# Altium schematic sheet 06. ETHERNET.SchDoc
size A
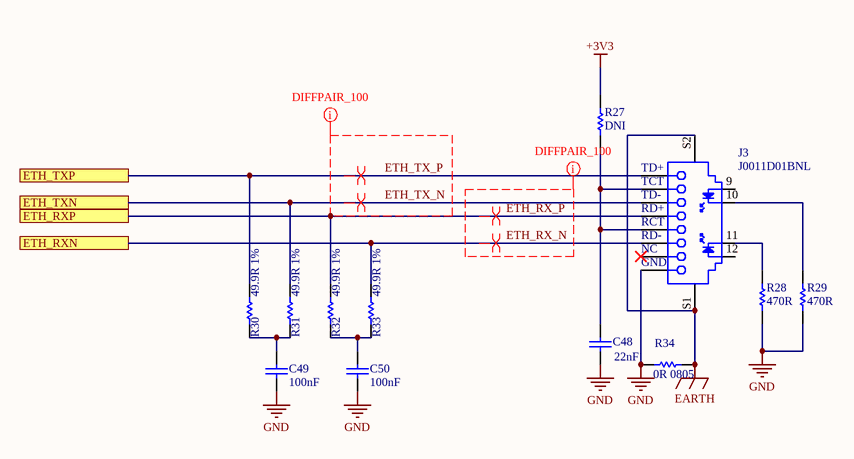
[diagram p0: 06. ETHERNET.SchDoc]

## Parts
C48  22nF  [CAPC1005X60X30LL05T10]
C49  100nF  [CAPC1005X60X30LL05T10]
C50  100nF  [CAPC1005X60X30LL05T10]
J3  J0011D01BNL  [J0011D01BNL 1PORT 100 BASE-TX]
R27  DNI  [RESC1005X40X25LL05T05]
R28  470R  [RESC1005X40X25LL05T05]
R29  470R  [RESC1005X40X25LL05T05]
R30  49.9R 1%  [RESC1005X40X25LL05T05]
R31  49.9R 1%  [RESC1005X40X25LL05T05]
R32  49.9R 1%  [RESC1005X40X25LL05T05]
R33  49.9R 1%  [RESC1005X40X25LL05T05]
R34  0R 0805  [RESC2013X50X30LL20T20]

## Ports
ETH_RXN, ETH_RXP, ETH_TXN, ETH_TXP

## Nets
+3V3: R27.2
EARTH: J3.S1 J3.S2 R34.2
GND: C48.1 C49.1 C50.1 J3.8(GND) R28.1 R29.1 R34.1
ETH_RX_N: J3.6(RD-) R33.2 ; port ETH_RXN
ETH_RX_P: J3.4(RD+) R32.2 ; port ETH_RXP
ETH_TX_N: J3.3(TD-) R31.2 ; port ETH_TXN
ETH_TX_P: J3.1(TD+) R30.2 ; port ETH_TXP
NetC48_2: C48.2 J3.2(TCT) J3.5(RCT) R27.1
NetC49_2: C49.2 R30.1 R31.1
NetC50_2: C50.2 R32.1 R33.1
NetJ3_10: J3.10 R29.2
NetJ3_11: J3.11 R28.2

Not connected (* = marked no-connect by the designer): J3 7(NC)* 9 12

## Layout directives
differential pair: ETH_RX_N, ETH_RX_P, ETH_TX_N, ETH_TX_P
net class ETHERNET; rule Matched Net Lengths [Tolerance = 10mil]: ETH_RX_N, ETH_RX_P, ETH_TX_N, ETH_TX_P

## Library data of the parts
C48 = CMP-2008-04654-1: Part Number: GRM155R71H223KA12D; Manufacturer: Murata
C49 C50 = CMP-2100-03641-1: Chip Capacitor, 0.1 uF, +/- 10%, 16 V, -55 to 125 degC, 0402 (1005 Metric), RoHS, Tape and Reel; Manufacturer: Murata; Material: Ceramic; Insulation Resistance: 10GR; Voltage: 16V; Dielectric: X7R; REACH SVHC: NoSVHC; Depth: 0.5mm; Case/Package: 0402; Datasheet URL: http://psearch.en.murata.com/capacitor/product/GRM155R71C104KA88%23.pdf; Lead Free: LeadFree; Dielectric Material: Ceramic; Manufacturer URL: http://www.murata.com/; Min Operating Temperature: -55degC; Length: 1mm; Case Code (Metric): 1005; Radiation Hardening: No; Package Reference: 0402; RoHSCompliant: true; Datasheet Version: 42675.0; Thickness: 0.022inch; Packaging: TapeandReel; Voltage Rating (DC): 16V; Tolerance: 10%; Max Operating Temperature: 125degC; Package Description: 2-Pin Surface Mount Device, Body 1 x 0.5 mm; Mount: SurfaceMount; Height: 0.5mm; Width: 0.5mm; Number of Pins: 2; Voltage Rating: 16V; Case Code (Imperial): 0402; Termination: SMD/SMT; Capacitance: 100nF; Package Quantity: 1
J3 = CMP-2000-06492-1: RJ45 Connector, Pitch 1.27 mm, 12 Position, Height 13.84 mm, Tail Length 3.3 mm, 0 to 70 degC, RoHS, Tray; Manufacturer: Pulse Electronics; Dynamic Catalog: PULSEJACK™J0andJ2Series; Shield Material: Brass; Shielding: Shielded; LED Color: Green-Yellow; Number of Ports: 1; Number of Cores per Jack: 4; Catalog Drawings: PULSEJACKRightAngle1x1; Other Names: 553-1483 / J0011D01BNL-ND; Tab Direction: Down; Package Description: RJ45 Connector, Pitch 1.27 mm, 12 Position, Height 13.84 mm, Tail Length 3.3 mm; Number of Rows: 1; Contact Finish Thickness: 15µin(0.38µm); Datasheet URL: http://productfinder.pulseeng.com/products/datasheets/J403.pdf; Connector Type: RJ45; Mounting Type: ThroughHole; Package Reference: J0-A; Orientation: 90°Angle(Right); Termination: Solder; Datasheet Version: Rev. K, 08/2012; Applications: 10/100Base-TX,AutoMDIX; Series: PULSEJACK™J0; Contact Finish: Gold; Height Above Board: 0.545"(13.84mm); Operating Temperature: 0°C~70°C; Packaging: Tray; Contact Material: PhosphorBronze; Standard Package: 30; Housing Material: Thermoplastic; Features: BoardGuide; Category: Connectors,Interconnects; Mounting Technology: ThroughHole; Manufacturer URL: http://www.pulseelectronics.com/; Family: ModularConnectors-JacksWithMagnetics
R27 = CMP-2002-03046-1: Part Number: CRCW040210R0FKEDHP; Manufacturer: Vishay Dale
R28 R29 = CMP-2000-03373-1: Part Number: CRCW0603470RFKEA; Manufacturer: Vishay Dale
R30-R33 = CMP-2002-00969-1: Precision Thick Film Chip Resistors; Manufacturer: Panasonic; Part Number: ERJ-2RKF49R9X
R34 = CMP-2001-04896-1: Manufacturer: Vishay Dale; Part Number: CRCW08050000Z0EA